# Altium schematic sheet RGB_LED.SchDoc
size A; SheetNumber: 13; SheetTotal: 15
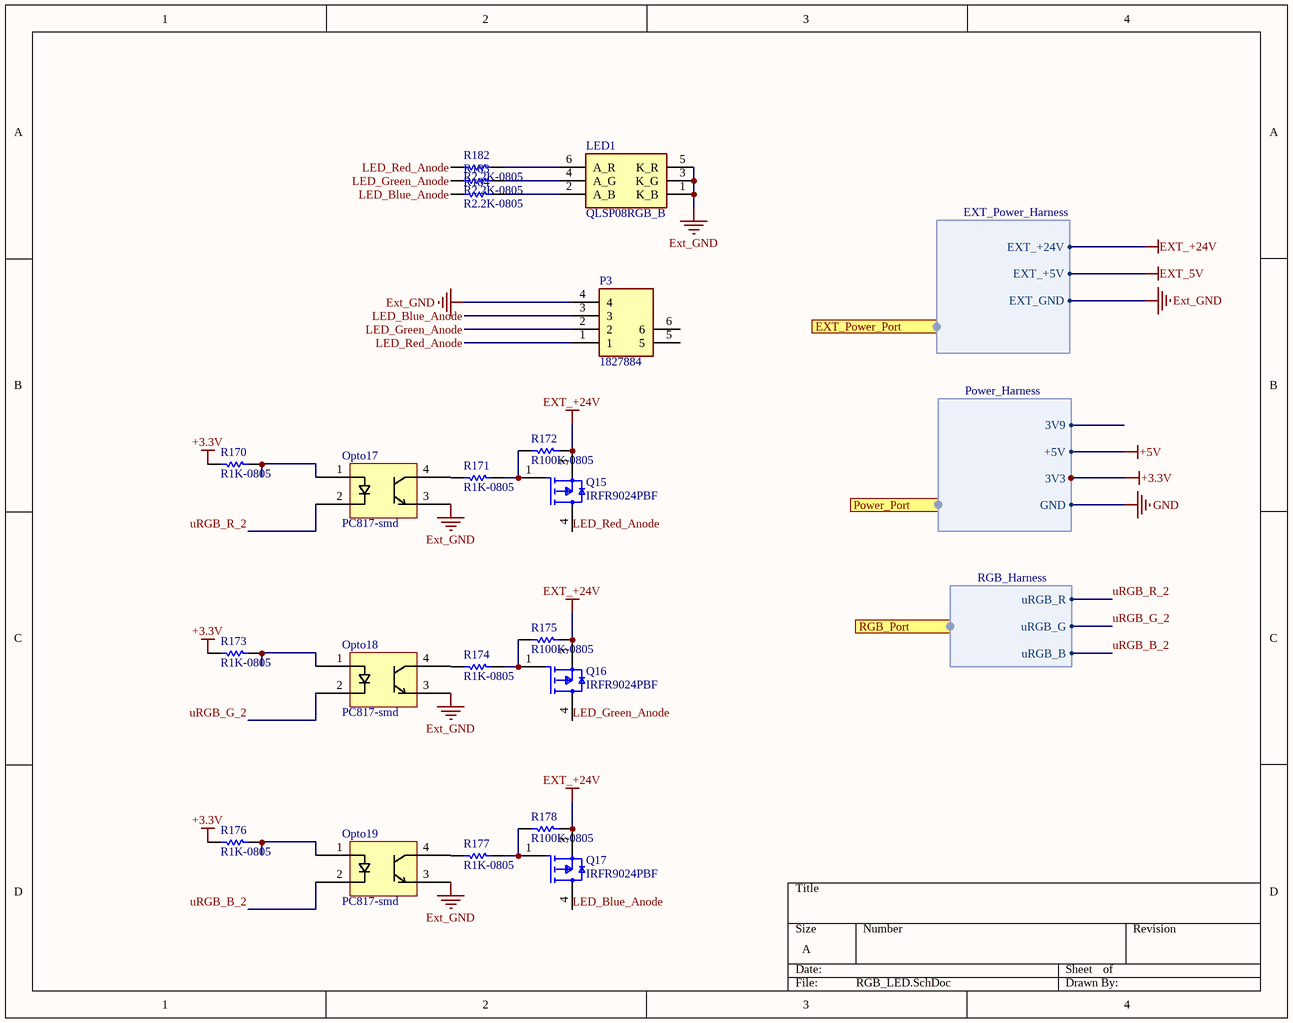
[diagram p0: RGB_LED.SchDoc]

## Parts
LED1  QLSP08RGB_B  [QLSP08RGB_B]
Opto17  PC817-smd  [PC817_SMD1]
Opto18  PC817-smd  [PC817_SMD1]
Opto19  PC817-smd  [PC817_SMD1]
P3  1827884  [1827884]
Q15  IRFR9024PBF  [FP-E22-0399-N-MFG]
Q16  IRFR9024PBF  [FP-E22-0399-N-MFG]
Q17  IRFR9024PBF  [FP-E22-0399-N-MFG]
R170  R1K-0805  [CRF06031]
R171  R1K-0805  [CRF06031]
R172  R100K-0805  [CRF06031]
R173  R1K-0805  [CRF06031]
R174  R1K-0805  [CRF06031]
R175  R100K-0805  [CRF06031]
R176  R1K-0805  [CRF06031]
R177  R1K-0805  [CRF06031]
R178  R100K-0805  [CRF06031]
R182  R2.2K-0805  [CRF06031]
R183  R2.2K-0805  [CRF06031]
R184  R2.2K-0805  [CRF06031]

## Ports
EXT_Power_Port (harness EXT_Power_Harness), Power_Port (harness Power_Harness), RGB_Port (harness RGB_Harness)

## Harnesses
Power_Harness: 3V9, +5V, 3V3, GND
EXT_Power_Harness: EXT_+24V, EXT_+5V, EXT_GND
RGB_Harness: uRGB_R, uRGB_G, uRGB_B

## Nets
+3.3V: R170.2 R173.2 R176.2 ; port Power_Port.3V3
+5V: port Power_Port.+5V
EXT_5V: port EXT_Power_Port.EXT_+5V
EXT_+24V: Q15.3(S) Q16.3(S) Q17.3(S) R172.2 R175.2 R178.2 ; port EXT_Power_Port.EXT_+24V
Ext_GND: LED1.1(K_B) LED1.3(K_G) LED1.5(K_R) Opto17.3 Opto18.3 Opto19.3 P3.4 ; port EXT_Power_Port.EXT_GND
GND: port Power_Port.GND
LED_Blue_Anode: P3.3 Q17.4(D) R184.1
LED_Green_Anode: P3.2 Q16.4(D) R183.1
LED_Red_Anode: P3.1 Q15.4(D) R182.1
uRGB_B_2: Opto19.2 ; port RGB_Port.uRGB_B
uRGB_G_2: Opto18.2 ; port RGB_Port.uRGB_G
uRGB_R_2: Opto17.2 ; port RGB_Port.uRGB_R
NetLED1_2: LED1.2(A_B) R184.2
NetLED1_4: LED1.4(A_G) R183.2
NetLED1_6: LED1.6(A_R) R182.2
NetOpto17_1: Opto17.1 R170.1
NetOpto17_4: Opto17.4 R171.2
NetOpto18_1: Opto18.1 R173.1
NetOpto18_4: Opto18.4 R174.2
NetOpto19_1: Opto19.1 R176.1
NetOpto19_4: Opto19.4 R177.2
NetQ15_1: Q15.1(G) R171.1 R172.1
NetQ16_1: Q16.1(G) R174.1 R175.1
NetQ17_1: Q17.1(G) R177.1 R178.1

Not connected (* = marked no-connect by the designer): P3 5 6

## Library data of the parts
LED1 = QLSP08RGB_B: LED; Manufacturer_Name: QUELIGHTING; Manufacturer_Part_Number: QLSP08RGB_B; Digi-Key_Part_Number: 3970-QLSP08RGB_BTR-ND; Manufacturer_P/N: QLSP08RGB_B; JLC P/N: C6629975
Opto17-Opto19 = PC817: Manufacturer_P/N: APC-817D1-SL; Digi-Key_Part_Number: 2007-APC-817D1-SLTR-ND; JLC P/N: C17448553
P3 = 1827884: Connector; Manufacturer_Name: Phoenix Contact; Manufacturer_Part_Number: 1827884; Mouser Part Number: 651-1827884; Arrow Part Number: 1827884; Digi-Key_Part_Number: 277-5791-ND; Manufacturer_P/N: 1827884; JLC P/N: C480609
Q15-Q17 = CMP-02550-000303-1: MOSFET P-CH 60V 8.8A DPAK; Mount: Surface Mount; Min Operating Temperature: -55°C; Digi-Key_Part_Number: IRFR9024PBF-ND; Manufacturer_P/N: IRFR9024PBF; JLC P/N: C727805
R170 R171 R173 R174 R176 R177 = Res1: Resistor; Manufacturer_P/N: RC0805FR-071KL; Digi-Key_Part_Number: 311-1.00KCRTR-ND; JLC P/N: C95781
R172 R175 R178 = Res1: Resistor; Manufacturer_P/N: RC0805FR-07100KL; Digi-Key_Part_Number: 311-100KCRTR-ND; JLC P/N: C96346
R182-R184 = Res1: Resistor; Manufacturer_P/N: RC0805FR-072K2L; Digi-Key_Part_Number: 311-2.20KCRTR-ND; JLC P/N: C114561